# Altium project CPU.PrjPcb
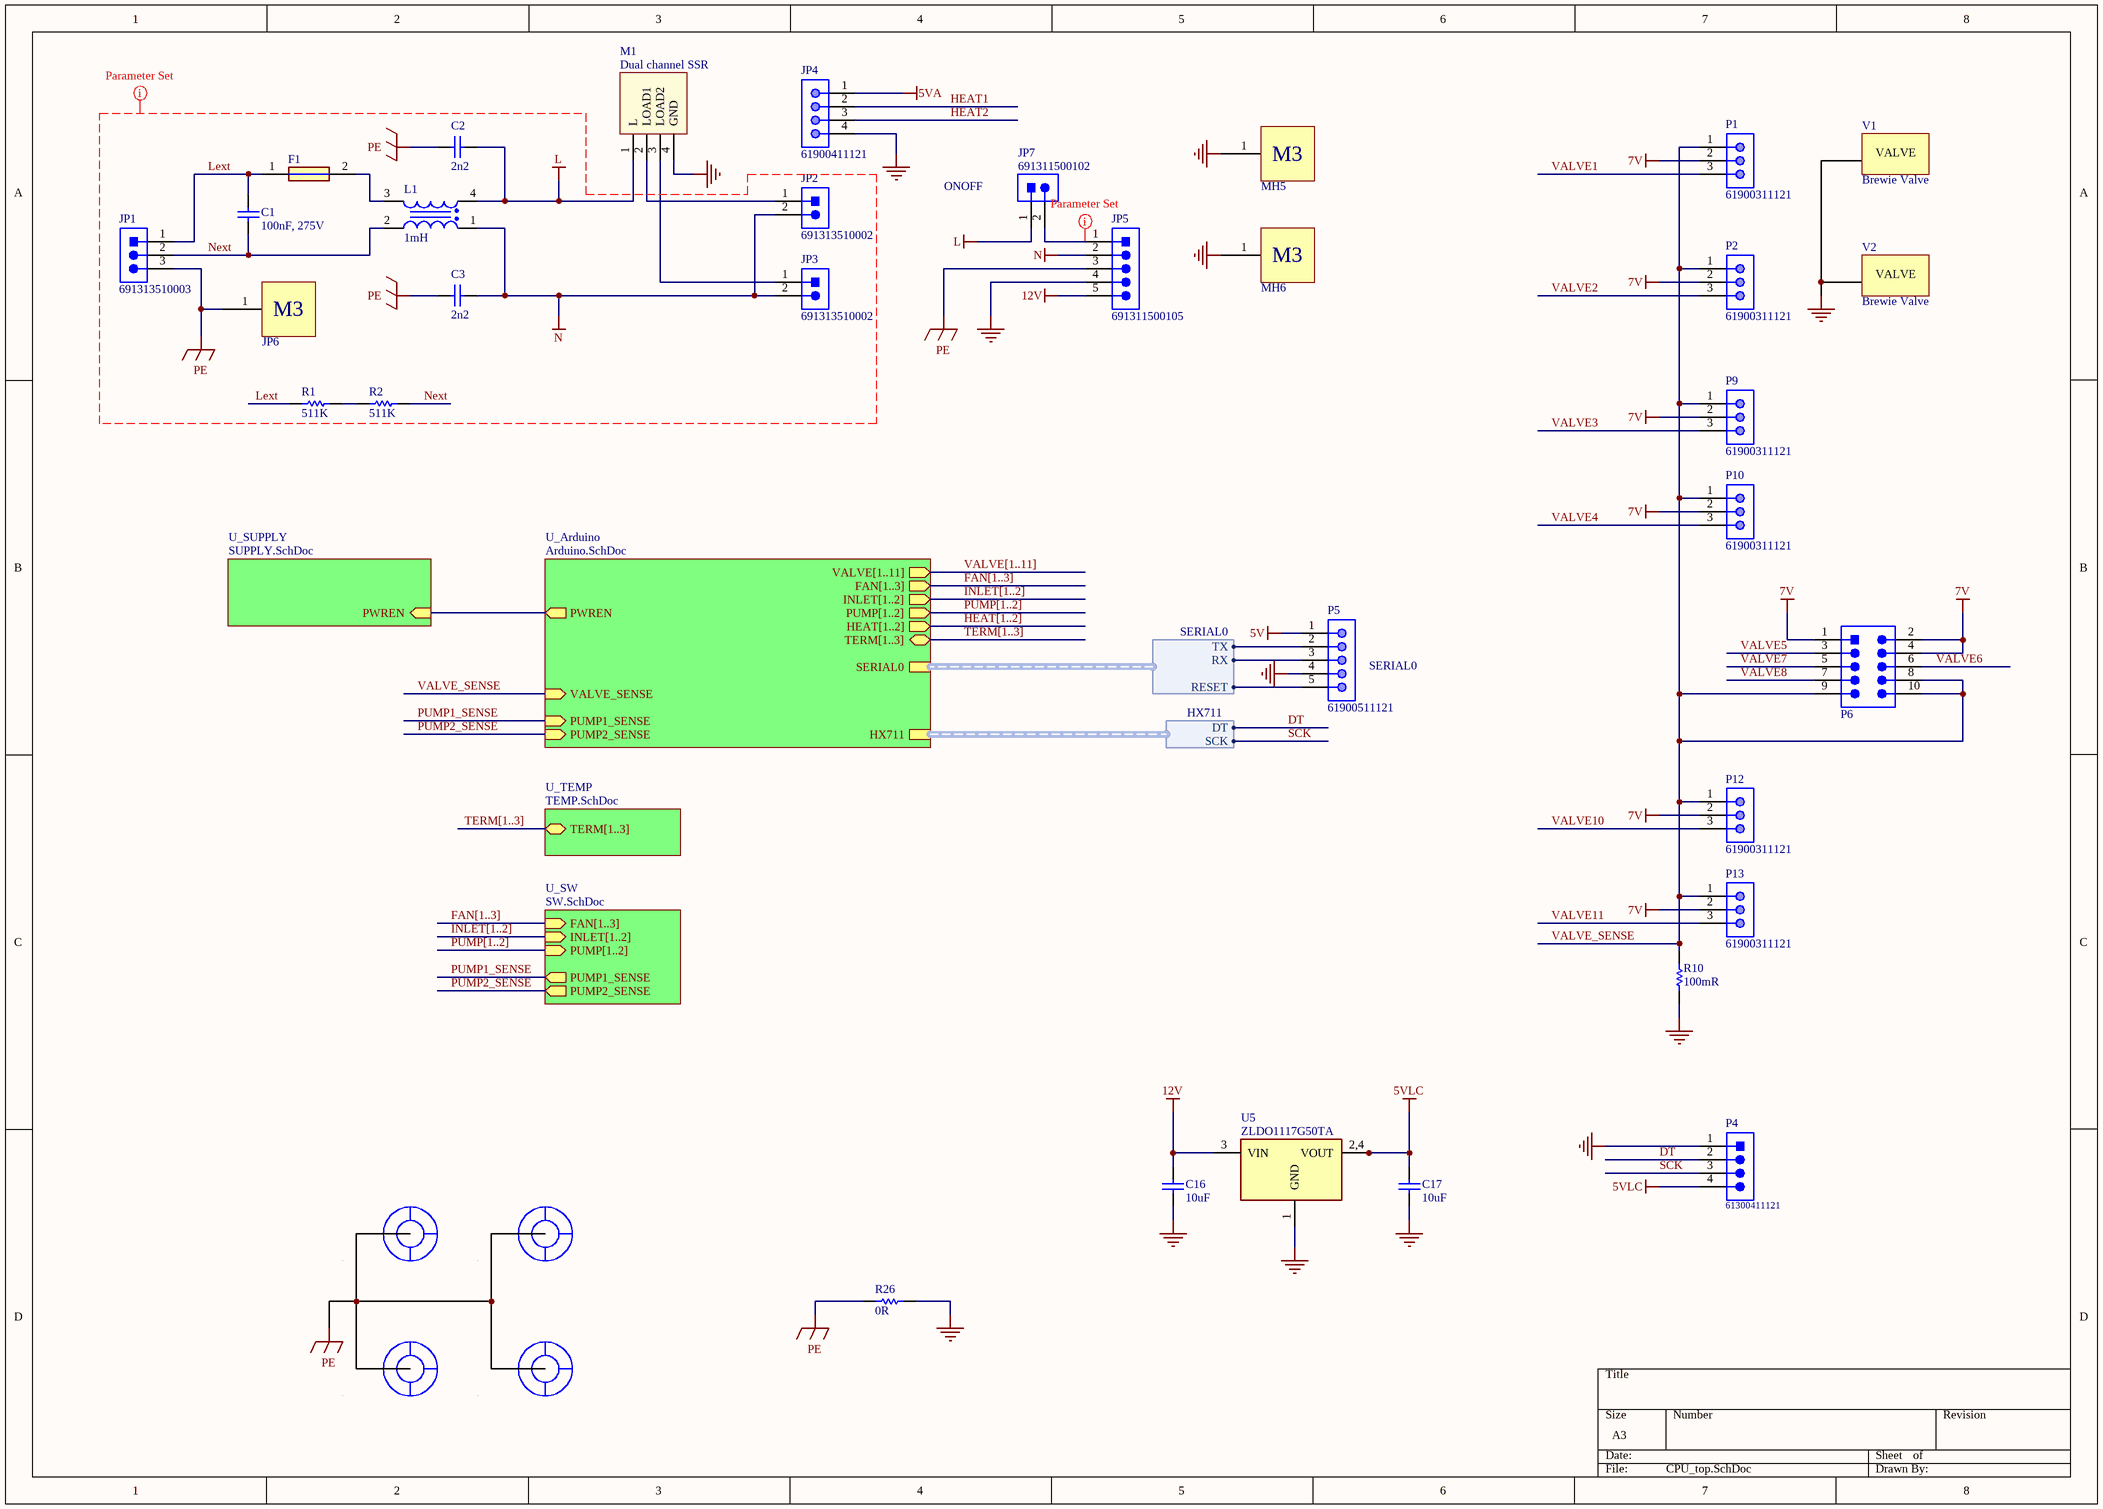
[diagram p0: CPU_top.SchDoc]
5 sheets, 95 parts. Net scope: hierarchical (ports join the sheet entries above them; power ports are global).
Board file: CPU.PcbDoc
Sheets:
  CPU_top.SchDoc
    U_SUPPLY = SUPPLY.SchDoc
    U_Arduino = Arduino.SchDoc
    U_TEMP = TEMP.SchDoc
    U_SW = SW.SchDoc

## Sheet CPU_top.SchDoc
size A3; SheetNumber: 1; SheetTotal: 5

### Parts
C1  100nF, 275V  [WCAP-FTX2_L13W7H13]
C2  value 2n2  [CAP CERDISC 9x5.5 P10 H13.0 (IPC RoHS)]  (hidden comment: CAP)
C3  value 2n2  [CAP CERDISC 9x5.5 P10 H13.0 (IPC RoHS)]  (hidden comment: CAP)
C16  value 10uF  [CAP_0805_H145 (_IPC_HD)]  (hidden comment: 10uF 0805)
C17  value 10uF  [CAP_0805_H145 (_IPC_HD)]  (hidden comment: 10uF 0805)
F1  SF-3812F1500T-2  [SF3812F1500T2]  (value not drawn)
JP1  691313510003  [691313510003]
JP2  691313510002  [691313510002]
JP3  691313510002  [691313510002]
JP4  61900411121  [61900411121]
JP5  691311500105  [691311500105]
JP6  Adafruit Standoff 6mm  [7466003]  (value not drawn)
JP7  691311500102  [691311500102]
L1  1mH  [744834101]
M1  Dual channel SSR  [SSR]
MH1  Mounting hole  [MECH_MHOLE_3.5-GND-2]  (value not drawn)  (no BOM)
MH2  Mounting hole  [MECH_MHOLE_3.5-GND-2]  (value not drawn)  (no BOM)
MH3  Mounting hole  [MECH_MHOLE_3.5-GND-2]  (value not drawn)  (no BOM)
MH4  Mounting hole  [MECH_MHOLE_3.5-GND-2]  (value not drawn)  (no BOM)
MH5  Adafruit Standoff 6mm  [7466003]  (value not drawn)
MH6  Adafruit Standoff 6mm  [7466003]  (value not drawn)
P1  61900311121  [61900311121]
P2  61900311121  [61900311121]
P4  61300411121  [61300411121]
P5  61900511121  [61900511121]
P6  61201021621  [61201021621]  (value not drawn)
P9  61900311121  [61900311121]
P10  61900311121  [61900311121]
P12  61900311121  [61900311121]
P13  61900311121  [61900311121]
R1  value 511K  [RES_1206_H060 (_IPC_MD)]  (hidden comment: 511K 1% 0,25W 200V 1206)
R2  value 511K  [RES_1206_H060 (_IPC_MD)]  (hidden comment: 511K 1% 0,25W 200V 1206)
R10  value 100mR  [RES_1206_H060 (_IPC_MD)]  (hidden comment: 100mR 1% 0,25W 200V 1206)
R26  value 0R  [RES_1206_H060 (_IPC_MD)]  (hidden comment: JUMPER)
U5  ZLDO1117G50TA  [SOT230P700X180-4N]
V1  Brewie Valve  [Valve2]
V2  Brewie Valve  [Valve2]

### Sub-sheets
U_Arduino = Arduino.SchDoc: VALVE[1..11] (out), FAN[1..3] (out), INLET[1..2] (out), PUMP[1..2] (out), HEAT[1..2] (out), PWREN (out), TERM[1..3] (bidir), SERIAL0 (harness SERIAL0), HX711 (harness HX711), VALVE_SENSE (in), PUMP1_SENSE (in), PUMP2_SENSE (in)
U_SUPPLY = SUPPLY.SchDoc: PWREN (in)
U_SW = SW.SchDoc: FAN[1..3] (in), INLET[1..2] (in), PUMP2_SENSE (out), PUMP1_SENSE (out), PUMP[1..2] (in)
U_TEMP = TEMP.SchDoc: TERM[1..3] (bidir)

### Harnesses
SERIAL0: TX, RX, RESET
HX711: DT, SCK

### Nets
5V: P5.1
5VA: JP4.1
5VLC: C17.2 P4.4 U5.2(VOUT_1) U5.4(VOUT)
7V: P1.2 P2.2 P6.1 P6.2 P6.4 P9.2 P10.2 P12.2 P13.2
12V: C16.2 JP5.5 U5.3(VIN)
GND: C16.1 C17.1 JP4.4 JP5.4 M1.4(GND) MH5.1 MH6.1 P4.1 P5.4 R10.1 R26.2 U5.1(GND) V1.1(CONN) V2.1(CONN)
L: C2.2 JP7.1 L1.4 M1.1(L)
N: C3.2 JP2.2 JP3.2 JP5.2 L1.1
PE: C2.1 C3.1 JP1.3 JP5.3 JP6.1 MH1.1(NET) MH2.1(NET) MH3.1(NET) MH4.1(NET) R26.1
DT: P4.2 ; sheet U_Arduino/HX711.DT
HEAT1: JP4.2
HEAT2: JP4.3
Lext: C1.2 F1.1 JP1.1 R1.1
Next: C1.1 JP1.2 L1.2 R2.2
PUMP1_SENSE: sheet U_Arduino/PUMP1_SENSE, sheet U_SW/PUMP1_SENSE
PUMP2_SENSE: sheet U_Arduino/PUMP2_SENSE, sheet U_SW/PUMP2_SENSE
PWREN: sheet U_SUPPLY/PWREN, sheet U_Arduino/PWREN
RESET: P5.5 ; sheet U_Arduino/SERIAL0.RESET
RX0: P5.3 ; sheet U_Arduino/SERIAL0.RX
SCK: P4.3 ; sheet U_Arduino/HX711.SCK
VALVE1: P1.3
VALVE2: P2.3
VALVE3: P9.3
VALVE4: P10.3
VALVE5: P6.3
VALVE6: P6.6
VALVE7: P6.5
VALVE8: P6.7
VALVE10: P12.3
VALVE11: P13.3
VALVE_SENSE: P1.1 P2.1 P6.8 P6.9 P6.10 P9.1 P10.1 P12.1 P13.1 R10.2 ; sheet U_Arduino/VALVE_SENSE
NetF1_2: F1.2 L1.3
NetJP2_1: JP2.1 M1.2(LOAD1)
NetJP3_1: JP3.1 M1.3(LOAD2)
NetJP5_1: JP5.1 JP7.2
NetP5_2: P5.2 ; sheet U_Arduino/SERIAL0.TX
NetR1_2: R1.2 R2.1

### Buses and harness runs
bus FAN[1..3] = sheet U_Arduino/FAN[1..3]
bus FAN[1..3] = sheet U_SW/FAN[1..3]
bus HEAT[1..2] = sheet U_Arduino/HEAT[1..2]
bus INLET[1..2] = sheet U_Arduino/INLET[1..2]
bus INLET[1..2] = sheet U_SW/INLET[1..2]
bus PUMP[1..2] = sheet U_Arduino/PUMP[1..2]
bus PUMP[1..2] = sheet U_SW/PUMP[1..2]
bus TERM[1..3] = sheet U_Arduino/TERM[1..3]
bus TERM[1..3] = sheet U_TEMP/TERM[1..3]
bus VALVE[1..11] = sheet U_Arduino/VALVE[1..11]

### Layout directives
net class HV: L, Lext, N, NetJP5_1, Next, PE

### Notes on the sheet
- ONOFF
- (near P5) SERIAL0
- (in symbol CONNM3) M3
- (in symbol Valve) VALVE
- (in symbol ZLDO1117G50TA) 2,4

### Library data of the parts
C1 = 890324023023: WCAP-FTX2 Film Capacitor, THT, L13W7H13, 100nF, 275V; Manufacturer: Wurth Elektronik; Insulation Resistance: 30000MOhm; Dissipation Factor@100kHz: 0.5%; Dissipation Factor@1kHz: 0.1%; Rated Voltage: 275VAC; Rate of Voltage Rise: 300V/us; Pitch: 10mm; Technical Reference: MX2P010104K275ASPB16000; Capacitance Tolerance: +/-10%; ComponentLink1Description: Manufacturer; ComponentLink1URL: http://www.we-online.de; ComponentLink2Description: Datasheet; ComponentLink2URL: https://www.we-online.com/catalog/datasheet/890324023023.pdf; Length: 13mm; Mounting Technology: THT; Operating Temperature: -40 to +105degC; Manufacturer Part Number: 890324023023; Width: 7mm; Capacitance: 100nF; Dissipation Factor@10kHz: 0.1%; Height: 13mm; Packaging: Carton; Published Date: May 2020
C2 C3 = 2235-0004: Cap X1Y1 2n2 400Vac 20% Y5V 4M E; Component: C921U222MVVDBA7317; Type: Standard; Designator: C; Curr: Typ X1/Y1; PCB Lib: EEPAB Hole mount.PcbLib; Scm Lib: Discrete.SchLib; Check: N; Create: Urband; Part Number: 2235-0004; EEPAB Prt Nr: 2235-0004; Volt: 400Vac; Tol: 20%; Qty: 1; Temp: E; PCB Footprint: CAP CERDISC 9x5.5 P10 H13.0 (IPC RoHS); Scm Symbol: CAP; Mfg Part Nr: C921U222MVVDBA7317; Supplier 1: Arrow; Supplier Part Number 1: C921U222MVVDBA7317; Supplier 2: Avnet; Supplier 3: Digi-Key; Supplier Part Number 3: 399-9487-1-ND; Supplier 4: Distrelec; Supplier 5: Farnell; Supplier Part Number 5: 2440214; Supplier 6: Future Electronics; Supplier 7: Mouser; Supplier Part Number 7: 80-C921U222MVVDBAP; Supplier 8: RSComponents; Supplier 9: Rutronik; Supplier 10: TTI
C16 C17 = 0805YD106KAT2A: CAP CER 10UF 16V X5R 0805; Type: Standard; Designator: C?; PCB Lib: MUAB_CAP.PcbLib; Scm Lib: Discrete.SchLib; Tol: 10%; Volt: 16V; Part Number: 0805YD106KAT2A; Dielec: X5R; Qty: 1; Supplier 1: Arrow; Supplier 2: Avnet; Supplier 3: Digi-Key; Supplier Part Number 3: 478-5165-1-ND; Supplier 4: Distrelec; Supplier 5: Farnell; Supplier 6: Future Electronics; Supplier 7: Mouser; Supplier Part Number 7: 581-0805YD106K; Supplier 8: RSComponents; Supplier 9: Rutronik; Supplier 10: SEED OPL
F1 = SF-3812F1500T-2: Fuse; Manufacturer_Name: Bourns; Datasheet Link: https://componentsearchengine.com//SF-3812F1500T-2.pdf; Height: 3.3mm; Manufacturer_Part_Number: SF-3812F1500T-2; Mouser Part Number: 652-SF-3812F1500T-2; Mouser Price/Stock: https://www.mouser.co.uk/ProductDetail/Bourns/SF-3812F1500T-2?qs=vLWxofP3U2y%252BowuZb8%2FTgg%3D%3D
JP1 = 691313510003: WR-TBL Serie 313 Close Horizontal PCB Header, Pluggable, THT, pitch 5.08mm, 3p; Manufacturer: Wurth Elektronik; Modularity: No; Pin Number: 3; Rated Current [UL]: 20A; Working Voltage [UL]: 300VAC; ComponentLink1Description: Manufacturer; ComponentLink1URL: http://www.we-online.de; ComponentLink2URL: https://katalog.we-online.de/em/datasheet/691313510003.pdf; ComponentLink2Description: Datasheet; Mounting Technology: THT; Manufacturer Part Number: 691313510003; Packaging: Box; Operating Temperature: -40 to +105degC; PCB/Cable/Panel: PCB; Pitch: 5.08mm; Published Date: Feburary 2021; Type: Horizontal; Application: Pluggable
JP2 JP3 = 691313510002: WR-TBL Serie 313 Close Horizontal PCB Header, Pluggable, THT, pitch 5.08mm, 2p; Manufacturer: Wurth Elektronik; Modularity: No; Pin Number: 2; Rated Current [UL]: 20A; Working Voltage [UL]: 300VAC; ComponentLink1Description: Manufacturer; ComponentLink1URL: http://www.we-online.de; ComponentLink2URL: https://katalog.we-online.de/em/datasheet/691313510002.pdf; ComponentLink2Description: Datasheet; Mounting Technology: THT; Manufacturer Part Number: 691313510002; Packaging: Box; Operating Temperature: -40 to +105degC; PCB/Cable/Panel: PCB; Pitch: 5.08mm; Published Date: Feburary 2021; Type: Horizontal; Application: Pluggable
JP4 = 61900411121: WR-WTB THT Male Vertical Locking Header, pitch 2.54mm, 4p; Pin Number: 4; Contact Resistance: 20mOhm; Rated Current: 3A; Withstanding Voltage: 1000VAC; Working Voltage: 250VAC; ComponentLink1Description: Manufacturer; ComponentLink1URL: http://www.we-online.de; ComponentLink2Description: Datasheet; ComponentLink2URL: https://www.we-online.com/catalog/datasheet/61900411121.pdf; Pitch: 2.54mm; Published Date: January 2020; Publisher: Wurth Elektronik; Mounting Technology: THT; Packaging: Bag; Operating Temperature: -40 to +105degC; Part Number: 61900411121; Gender: Male; Type: Vertical
JP5 = 691311500105: WR-TBL Serie 311 Close Vertical PCB Header, Pluggable, THT, pitch 5.08mm, 5p; Manufacturer: Wurth Elektronik; Modularity: No; Pin Number: 5; Rated Current [UL]: 20A; Working Voltage [UL]: 300VAC; ComponentLink1Description: Manufacturer; ComponentLink1URL: http://www.we-online.de; ComponentLink2URL: https://katalog.we-online.de/em/datasheet/691311500105.pdf; ComponentLink2Description: Datasheet; Mounting Technology: THT; Manufacturer Part Number: 691311500105; Packaging: Box; Operating Temperature: -40 to +105degC; PCB/Cable/Panel: PCB; Pitch: 5.08mm; Published Date: Feburary 2021; Type: Vertical; Application: Pluggable
JP6 MH5 MH6 = CONNM3: Manufacturer: Adafruit; Height: 6mm
JP7 = 691311500102: WR-TBL Serie 311 Close Vertical PCB Header, Pluggable, THT, pitch 5.08mm, 2p; Manufacturer: Wurth Elektronik; Modularity: No; Pin Number: 2; Rated Current [UL]: 20A; Working Voltage [UL]: 300VAC; ComponentLink1Description: Manufacturer; ComponentLink1URL: http://www.we-online.de; ComponentLink2URL: https://katalog.we-online.de/em/datasheet/691311500102.pdf; ComponentLink2Description: Datasheet; Mounting Technology: THT; Manufacturer Part Number: 691311500102; Packaging: Box; Operating Temperature: -40 to +105degC; PCB/Cable/Panel: PCB; Pitch: 5.08mm; Published Date: Feburary 2021; Type: Vertical; Application: Pluggable
L1 = 744834101: WE-CMBH Common Mode Power Line Choke, Type L, 1mH; Manufacturer: Wurth Elektronik; Rated Current: 10A; DC Resistance max.: 12.5mOhm; Insulation Test Voltage: 1500VAC; Rated Voltage: 250VAC; ComponentLink1Description: Manufacturer; ComponentLink1URL: http://www.we-online.de; ComponentLink2Description: Datasheet; ComponentLink2URL: https://www.we-online.com/catalog/datasheet/744834101.pdf; Manufacturer Part Number: 744834101; Published Date: April 2020; Inductance: 1mH; Operating Temperature: -40 to +125degC; Mounting Technology: THT; Packaging: Tray; Size: Type L
M1 = SSR
MH1-MH4 = MECH_MHOLE_NET
P1 P2 P9 P10 P12 P13 = 61900311121: WR-WTB THT Male Vertical Locking Header, pitch 2.54mm, 3p; Pin Number: 3; Contact Resistance: 20mOhm; Rated Current: 3A; Withstanding Voltage: 1000VAC; Working Voltage: 250VAC; ComponentLink1Description: Manufacturer; ComponentLink1URL: http://www.we-online.de; ComponentLink2Description: Datasheet; ComponentLink2URL: https://www.we-online.com/catalog/datasheet/61900311121.pdf; Pitch: 2.54mm; Published Date: January 2020; Publisher: Wurth Elektronik; Mounting Technology: THT; Packaging: Bag; Operating Temperature: -40 to +105degC; Part Number: 61900311121; Gender: Male; Type: Vertical
P4 = 61300411121: WR-PHD Pin Header, THT, pitch 2.54mm, Single Row, Vertical, 4p; Manufacturer: Wurth Elektronik; Pin Number: 4; Rated Current: 3A; Working Voltage: 250VAC; Withstanding Voltage: 500VAC; Contact Resistance: 20mOhm; ComponentLink1Description: Manufacturer; ComponentLink1URL: http://www.we-online.de; ComponentLink2Description: Datasheet; ComponentLink2URL: https://www.we-online.com/catalog/datasheet/61300411121.pdf; Manufacturer Part Number: 61300411121; Pitch: 2.54mm; Operating Temperature: -40 to +105degC; Mounting Technology: THT; Packaging: Bag; Gender: Pin Header; Row Number: Single; Orientation: Vertical
P5 = 61900511121: WR-WTB THT Male Vertical Locking Header, pitch 2.54mm, 5p; Pin Number: 5; Contact Resistance: 20mOhm; Rated Current: 3A; Withstanding Voltage: 1000VAC; Working Voltage: 250VAC; ComponentLink1Description: Manufacturer; ComponentLink1URL: http://www.we-online.de; ComponentLink2Description: Datasheet; ComponentLink2URL: https://www.we-online.com/catalog/datasheet/61900511121.pdf; Pitch: 2.54mm; Published Date: January 2020; Publisher: Wurth Elektronik; Mounting Technology: THT; Packaging: Bag; Operating Temperature: -40 to +105degC; Part Number: 61900511121; Gender: Male; Type: Vertical
P6 = 61201021621: WR-BHD Box Header, Male, pitch 2.54mm, THT, Straight, 10p; Manufacturer: Wurth Elektronik; Contact Resistance: 20mOhm; Insulation Resistance: 1000MOhm; Number of Positions: 10; Rated Current: 3A; Withstanding Voltage: 500V; Working Voltage: 250V; ComponentLink1Description: Manufacturer Link; ComponentLink1URL: http://www.we-online.de; ComponentLink2Description: Datasheet; ComponentLink2URL: https://www.we-online.com/catalog/datasheet/61201021621.pdf; Gender: Male; Height: 9.1mm; Length: 20.36mm; Manufacturer Part Number: 61201021621; Mounting Technology: THT; Number of Rows: 2; Operating Temperature max.: 105C; Operating Temperature min.: -40C; Orientation: Straight; Packaging: Tray; Pitch: 2.54mm; Width: 9.1mm
R1 R2 = RES511K1%1206: Designator: R; PCB Lib: MUAB_RES.PcbLib; Scm Lib: Discrete.SchLib; Watt: 0,25W; Tol: 1%; Part Number: RES511K1%1206; Type: Standard; Volt: 200V; Qty: 1; Supplier 1: Arrow; Supplier 2: Avnet; Supplier 3: Digi-Key; Supplier 4: Distrelec; Supplier 5: Farnell; Supplier 6: Future Electronics; Supplier 7: Mouser; Supplier 8: RSComponents; Supplier 9: Rutronik; Supplier 10: SEED OPL
R10 = RES100mR1%1206: Designator: R; PCB Lib: MUAB_RES.PcbLib; Scm Lib: Discrete.SchLib; Watt: 0,25W; Tol: 1%; Part Number: RES100mR1%1206; Type: Standard; Volt: 200V; Qty: 1; Supplier 1: Arrow; Supplier 2: Avnet; Supplier 3: Digi-Key; Supplier 4: Distrelec; Supplier 5: Farnell; Supplier 6: Future Electronics; Supplier 7: Mouser; Supplier 8: RSComponents; Supplier 9: Rutronik; Supplier 10: SEED OPL
R26 = JUMPER1206: Tol: 1%; Designator: R; PCB Lib: MUAB_RES.PcbLib; Scm Lib: Discrete.SchLib; Volt: 200V; Watt: 0,25W; Part Number: JUMPER1206; Type: Standard; Qty: 1; Supplier 1: Arrow; Supplier 2: Avnet; Supplier 3: Digi-Key; Supplier 4: Distrelec; Supplier 5: Farnell; Supplier 6: Future Electronics; Supplier 7: Mouser; Supplier 8: RSComponents; Supplier 9: Rutronik; Supplier 10: SEED OPL
U5 = ZLDO1117G50TA: IC REG LINEAR 3.3V 1A SOT223; Manufacturer_Name: Diodes Inc.; Designator: U; Volt: 18V; Volt Out: 5.0V; Temp: I; Datasheet Link: https://datasheet.datasheetarchive.com/originals/distributors/Datasheets-DIO/DSADIO2000767.pdf; Height: 1.8mm; Manufacturer_Part_Number: ZLDO1117G33TA; Mouser Part Number: 522-ZLDO1117G33TA; Mouser Price/Stock: https://www.mouser.co.uk/ProductDetail/Diodes-Incorporated/ZLDO1117G33TA?qs=4YT44p7w2bvlytOS2j%2F0vw%3D%3D; Arrow Part Number: ZLDO1117G33TA; Arrow Price/Stock: https://www.arrow.com/en/products/zldo1117g33ta/diodes-incorporated?region=nac; Part Number: ZLDO1117G50TA; Component: ZLDO1117G50TA; Type: Standard; Curr: 1A; Qty: 1; Supplier 1: Arrow; Supplier 2: Avnet; Supplier 3: Digi-Key; Supplier Part Number 3: ZLDO1117G50DICT-ND; Supplier 4: Distrelec; Supplier 5: Farnell; Supplier 6: Future Electronics; Supplier 7: Mouser; Supplier Part Number 7: 522-ZLDO1117G50TA; Supplier 8: RSComponents; Supplier 9: Rutronik; Supplier 10: TTI
V1 V2 = Valve

## Sheet SUPPLY.SchDoc
size A3; SheetNumber: 2; SheetTotal: 2
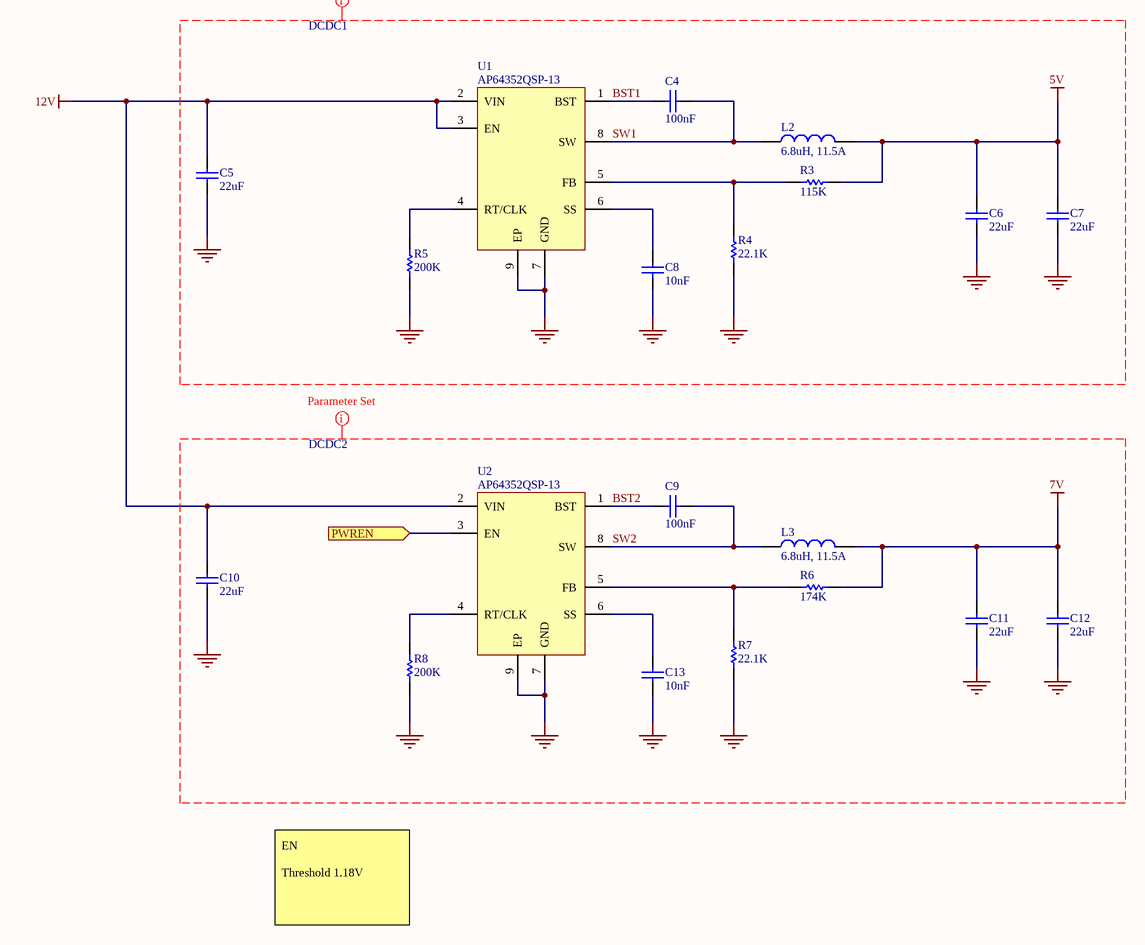
[diagram p1: SUPPLY.SchDoc]

### Parts
C4  value 100nF  [CAP_0603_H090 (_IPC_MD)]  (hidden comment: 100nF 0603)
C5  value 22uF  [CAP_1210_H090 (_IPC_HD)]  (hidden comment: 22uF 1210)
C6  value 22uF  [CAP_1210_H090 (_IPC_HD)]  (hidden comment: 22uF 1210)
C7  value 22uF  [CAP_1210_H090 (_IPC_HD)]  (hidden comment: 22uF 1210)
C8  value 10nF  [CAP_0603_H090 (_IPC_MD)]  (hidden comment: 10nF 0603)
C9  value 100nF  [CAP_0603_H090 (_IPC_MD)]  (hidden comment: 100nF 0603)
C10  value 22uF  [CAP_1210_H090 (_IPC_HD)]  (hidden comment: 22uF 1210)
C11  value 22uF  [CAP_1210_H090 (_IPC_HD)]  (hidden comment: 22uF 1210)
C12  value 22uF  [CAP_1210_H090 (_IPC_HD)]  (hidden comment: 22uF 1210)
C13  value 10nF  [CAP_0603_H090 (_IPC_MD)]  (hidden comment: 10nF 0603)
L2  6.8uH, 11.5A  [WE-HCC_1090]
L3  6.8uH, 11.5A  [WE-HCC_1090]
R3  value 115K  [RES_0603_H050 (_IPC_MD)]  (hidden comment: 115K 1% 0,1W 75V 0603)
R4  value 22.1K  [RES_0603_H050 (_IPC_MD)]  (hidden comment: 22.1K 1% 0,1W 75V 0603)
R5  value 200K  [RES_0603_H050 (_IPC_MD)]  (hidden comment: 200K 1% 0,1W 75V 0603)
R6  value 174K  [RES_0603_H050 (_IPC_MD)]  (hidden comment: 174K 1% 0,1W 75V 0603)
R7  value 22.1K  [RES_0603_H050 (_IPC_MD)]  (hidden comment: 22.1K 1% 0,1W 75V 0603)
R8  value 200K  [RES_0603_H050 (_IPC_MD)]  (hidden comment: 200K 1% 0,1W 75V 0603)
U1  AP64352QSP-13  [SOIC127P600X163-9N]
U2  AP64352QSP-13  [SOIC127P600X163-9N]

### Ports
PWREN (in)

### Nets
5V: C6.2 C7.2 L2.2 R3.2
7V: C11.2 C12.2 L3.2 R6.2
12V: C5.2 C10.2 U1.2(VIN) U1.3(EN) U2.2(VIN)
GND: C5.1 C6.1 C7.1 C8.1 C10.1 C11.1 C12.1 C13.1 R4.1 R5.1 R7.1 R8.1 U1.7(GND) U1.9(EP) U2.7(GND) U2.9(EP)
BST1: C4.2 U1.1(BST)
BST2: C9.2 U2.1(BST)
PWREN: U2.3(EN) ; port PWREN
SW1: C4.1 L2.1 U1.8(SW)
SW2: C9.1 L3.1 U2.8(SW)
NetC8_2: C8.2 U1.6(SS)
NetC13_2: C13.2 U2.6(SS)
NetR3_1: R3.1 R4.2 U1.5(FB)
NetR5_2: R5.2 U1.4(RT/CLK)
NetR6_1: R6.1 R7.2 U2.5(FB)
NetR8_2: R8.2 U2.4(RT/CLK)

### Layout directives
CompClassName: DCDC1: 5V, BST1, GND, SW1
CompClassName: DCDC2: 7V, BST2, GND, SW2

### Notes on the sheet
- EN
  Threshold 1.18V

### Library data of the parts
C4 C9 = CL10B104KB8NNNC: CAP CER 100NF 50V X7R 0603; Type: Standard; Designator: C?; PCB Lib: MUAB_CAP.PcbLib; Scm Lib: Discrete.SchLib; Tol: 10%; Volt: 50V; Part Number: CL10B104KB8NNNC; Dielec: X7R; Qty: 1; Supplier 1: Arrow; Supplier 2: Avnet; Supplier 3: Digi-Key; Supplier Part Number 3: 1276-1000-1-ND; Supplier 4: Distrelec; Supplier 5: Farnell; Supplier 6: Future Electronics; Supplier 7: Mouser; Supplier Part Number 7: 187-CL10B104KB8NNNC; Supplier 8: RSComponents; Supplier 9: Rutronik; Supplier 10: SEED OPL
C5-C7 C10-C12 = MA1210XR226K250ER: CAP CER 22UF 25V X7R 1210; Type: Standard; Designator: C?; PCB Lib: MUAB_CAP.PcbLib; Scm Lib: Discrete.SchLib; Tol: 10%; Volt: 25V; Part Number: MA1210XR226K250ER; Dielec: X7R; Qty: 1; Supplier 1: Arrow; Supplier 2: Avnet; Supplier 3: Digi-Key; Supplier 4: Distrelec; Supplier 5: Farnell; Supplier 6: Future Electronics; Supplier 7: Mouser; Supplier 8: RSComponents; Supplier 9: Rutronik; Supplier 10: SEED OPL
C8 C13 = CGA3E2C0G1H103J080AA: CAP CER 10NF 50V C0G/NP0 0603; Type: Standard; Designator: C?; PCB Lib: MUAB_CAP.PcbLib; Scm Lib: Discrete.SchLib; Dielec: C0G; Tol: 5%; Volt: 50V; Part Number: CGA3E2C0G1H103J080AA; Qty: 1; Supplier 1: Arrow; Supplier 2: Avnet; Supplier 3: Digi-Key; Supplier Part Number 3: 445-6916-1-ND; Supplier 4: Distrelec; Supplier 5: Farnell; Supplier 6: Future Electronics; Supplier 7: Mouser; Supplier Part Number 7: 810-CGA3E2C0G1H103J; Supplier 8: RSComponents; Supplier 9: Rutronik; Supplier 10: SEED OPL
L2 L3 = 7443330680: WE-HCC SMT High Current Cube Inductor, size 1090, 6.8uH, 11.5A; Manufacturer: Wurth Elektronik; Saturation Current: 11A; DC Resistance typ.: 14.15mOhm; DC Resistance max.: 15mOhm; Rated Inductance: 4.5uH; Material: Ferrite; Self Resonant Frequency: 40MHz; ComponentLink1Description: Manufacturer; ComponentLink1URL: http://www.we-online.de; ComponentLink2Description: Datasheet; ComponentLink2URL: https://www.we-online.com/catalog/datasheet/7443330680.pdf; Mounting Technology: SMT; Operating Temperature: -40 to +125degC; Packaging: Tape and Reel; Manufacturer Part Number: 7443330680; Rated Current: 11.5A; Inductance: 6.8uH; Size: 1090; Height: 9.3mm; Length: 10.9mm; Width: 10mm
R3 = RES115K1%0603: Designator: R; PCB Lib: MUAB_RES.PcbLib; Scm Lib: Discrete.SchLib; Watt: 0,1W; Tol: 1%; Part Number: RES115K1%0603; Type: Standard; Volt: 75V; Qty: 1; Supplier 1: Arrow; Supplier 2: Avnet; Supplier 3: Digi-Key; Supplier 4: Distrelec; Supplier 5: Farnell; Supplier 6: Future Electronics; Supplier 7: Mouser; Supplier 8: RSComponents; Supplier 9: Rutronik; Supplier 10: SEED OPL
R4 R7 = RES22.1K1%0603: Designator: R; PCB Lib: MUAB_RES.PcbLib; Scm Lib: Discrete.SchLib; Watt: 0,1W; Tol: 1%; Part Number: RES22.1K1%0603; Type: Standard; Volt: 75V; Qty: 1; Supplier 1: Arrow; Supplier 2: Avnet; Supplier 3: Digi-Key; Supplier 4: Distrelec; Supplier 5: Farnell; Supplier 6: Future Electronics; Supplier 7: Mouser; Supplier 8: RSComponents; Supplier 9: Rutronik; Supplier 10: SEED OPL
R5 R8 = RES200K1%0603: Designator: R; PCB Lib: MUAB_RES.PcbLib; Scm Lib: Discrete.SchLib; Watt: 0,1W; Tol: 1%; Part Number: RES200K1%0603; Type: Standard; Volt: 75V; Qty: 1; Supplier 1: Arrow; Supplier 2: Avnet; Supplier 3: Digi-Key; Supplier 4: Distrelec; Supplier 5: Farnell; Supplier 6: Future Electronics; Supplier 7: Mouser; Supplier 8: RSComponents; Supplier 9: Rutronik; Supplier 10: SEED OPL
R6 = RES174K1%0603: Designator: R; PCB Lib: MUAB_RES.PcbLib; Scm Lib: Discrete.SchLib; Watt: 0,1W; Tol: 1%; Part Number: RES174K1%0603; Type: Standard; Volt: 75V; Qty: 1; Supplier 1: Arrow; Supplier 2: Avnet; Supplier 3: Digi-Key; Supplier 4: Distrelec; Supplier 5: Farnell; Supplier 6: Future Electronics; Supplier 7: Mouser; Supplier 8: RSComponents; Supplier 9: Rutronik; Supplier 10: SEED OPL
U1 U2 = AP64352QSP-13: DCDC CONV HV BUCK SO-8EP T&R 4K; Designator: U; Volt: 3.8V to 40V; Volt Out: ADJ; Curr: 3.5A; Temp: I; Part Number: AP64352QSP-13; Component: AP64352; Type: Standard; Qty: 1; Supplier 1: Arrow; Supplier 2: Avnet; Supplier 3: Digi-Key; Supplier Part Number 3: 31-AP64352QSP-13CT-ND; Supplier 4: Distrelec; Supplier 5: Farnell; Supplier 6: Future Electronics; Supplier 7: Mouser; Supplier Part Number 7: 621-AP64352QSP-13; Supplier 8: RSComponents; Supplier 9: Rutronik; Supplier 10: TTI

## Sheet Arduino.SchDoc
size A3; SheetNumber: 3; SheetTotal: 5
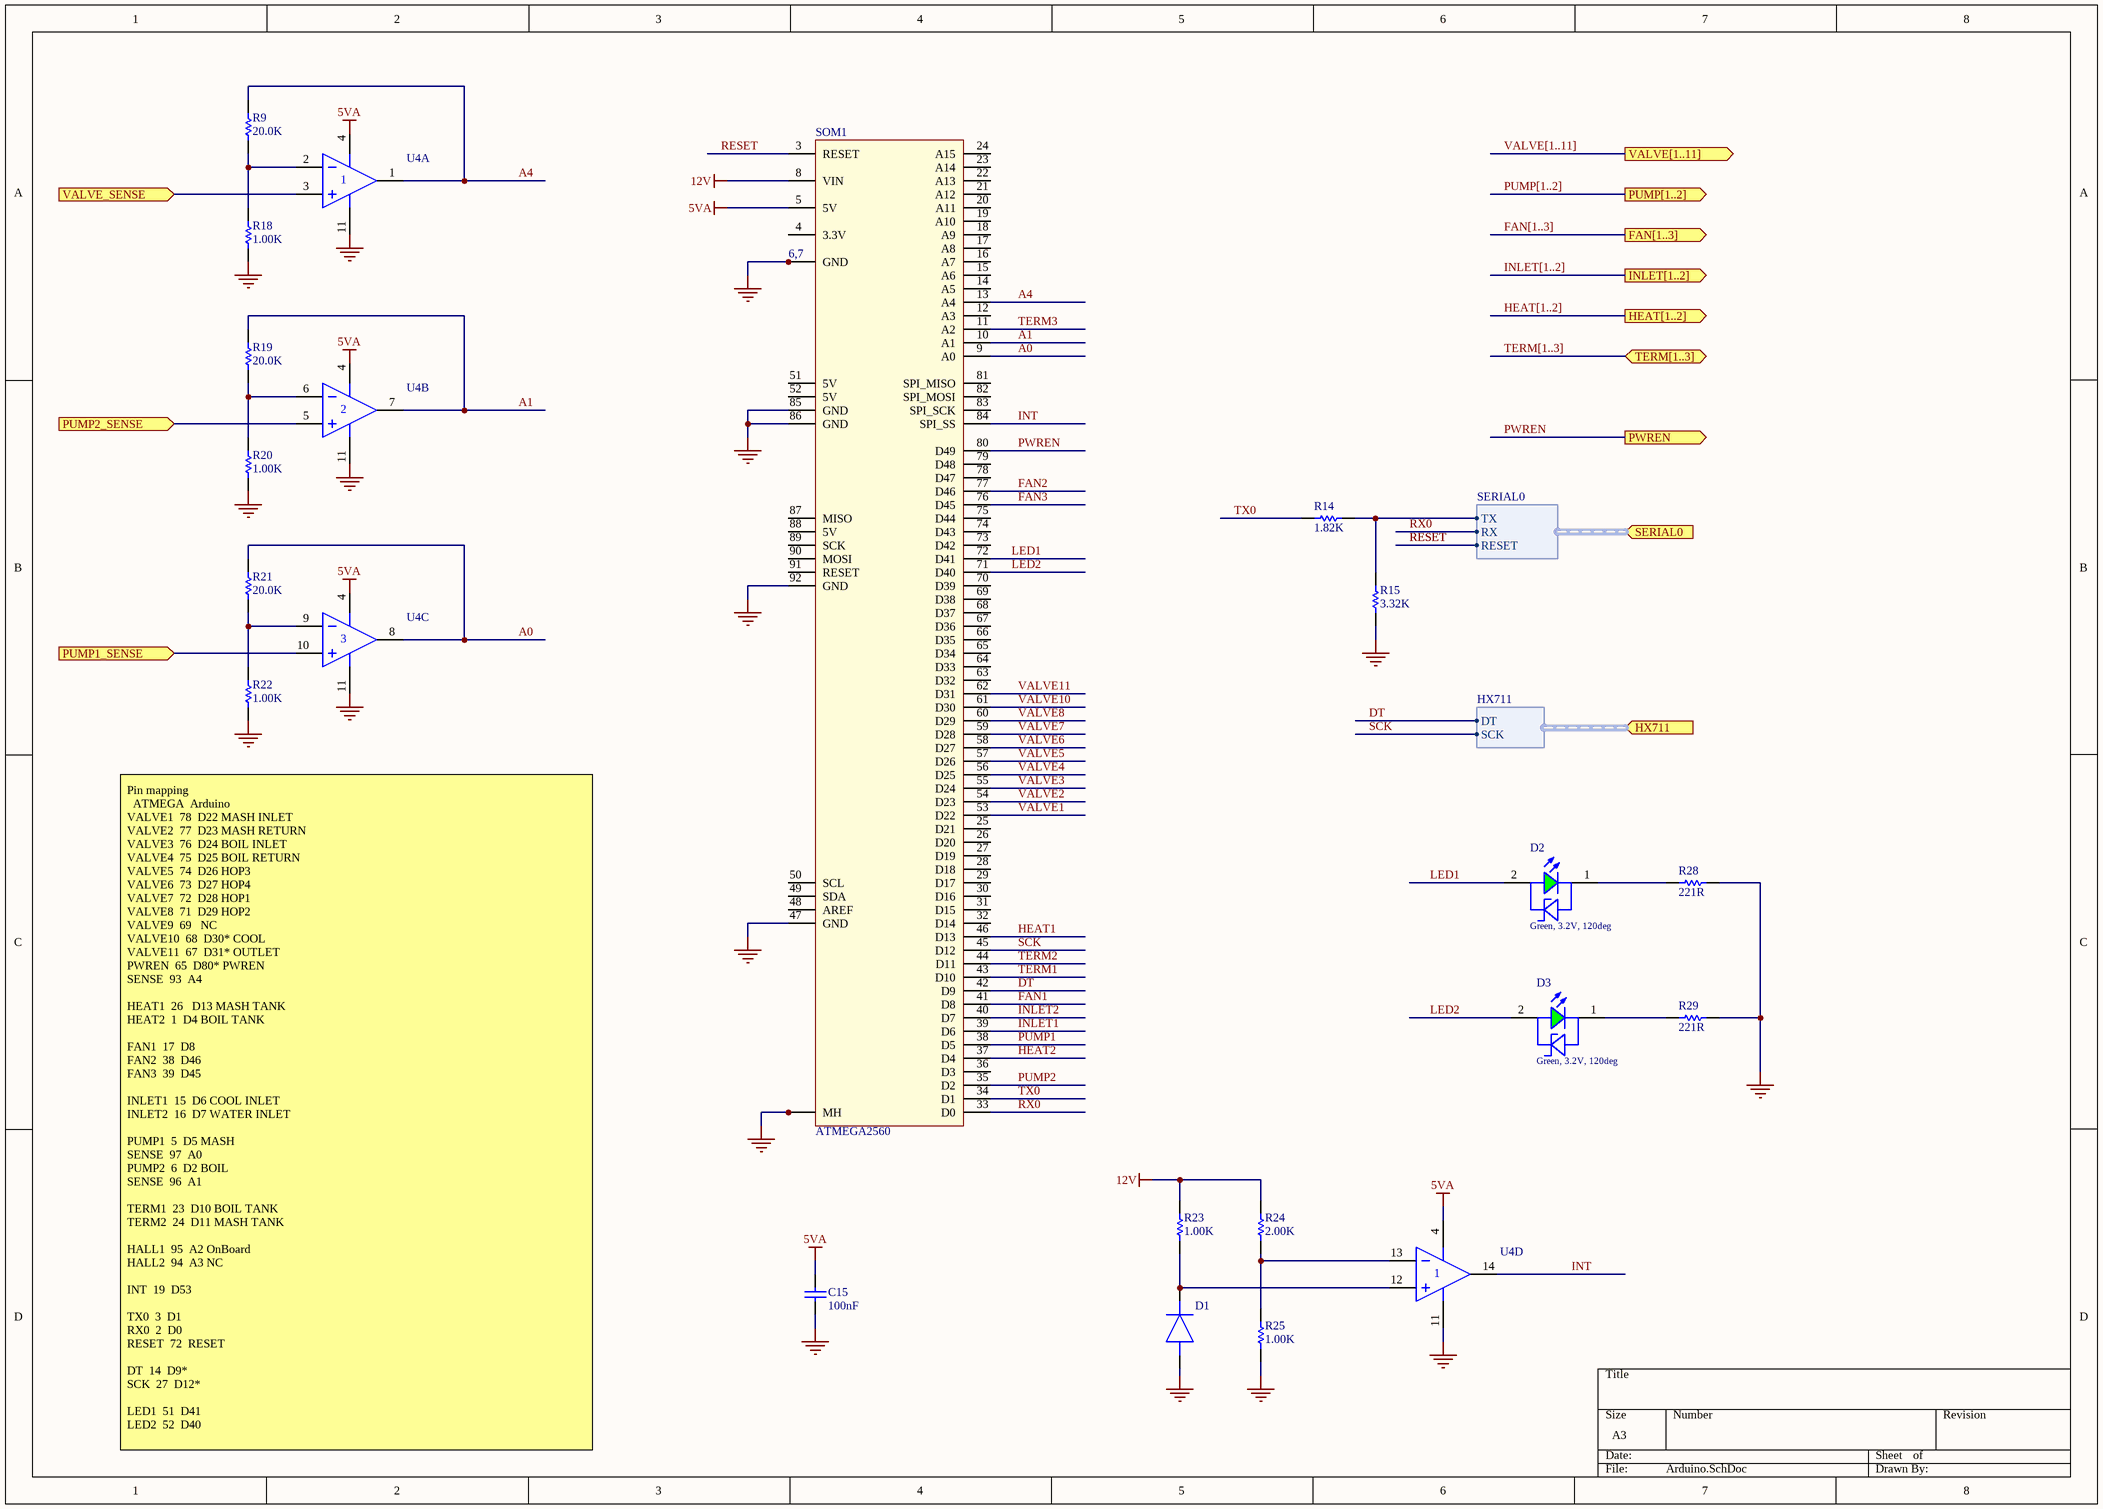
[diagram p2: Arduino.SchDoc]

### Parts
C15  value 100nF  [CAP_0603_H090 (_IPC_MD)]  (hidden comment: 100nF 0603)
D1  LL4148-GS18  [SOD-80]  (value not drawn)
D2  Green, 3.2V, 120deg  [WL-SMCC_0603_GS_BS]
D3  Green, 3.2V, 120deg  [WL-SMCC_0603_GS_BS]
R9  value 20.0K  [RES_0603_H050 (_IPC_MD)]  (hidden comment: 20.0K 1% 0,1W 75V 0603)
R14  value 1.82K  [RES_0603_H050 (_IPC_MD)]  (hidden comment: 1.82K 1% 0,1W 75V 0603)
R15  value 3.32K  [RES_0603_H050 (_IPC_MD)]  (hidden comment: 3.32K 1% 0,1W 75V 0603)
R18  value 1.00K  [RES_0603_H050 (_IPC_MD)]  (hidden comment: 1.00K 1% 0,1W 75V 0603)
R19  value 20.0K  [RES_0603_H050 (_IPC_MD)]  (hidden comment: 20.0K 1% 0,1W 75V 0603)
R20  value 1.00K  [RES_0603_H050 (_IPC_MD)]  (hidden comment: 1.00K 1% 0,1W 75V 0603)
R21  value 20.0K  [RES_0603_H050 (_IPC_MD)]  (hidden comment: 20.0K 1% 0,1W 75V 0603)
R22  value 1.00K  [RES_0603_H050 (_IPC_MD)]  (hidden comment: 1.00K 1% 0,1W 75V 0603)
R23  value 1.00K  [RES_0603_H050 (_IPC_MD)]  (hidden comment: 1.00K 1% 0,1W 75V 0603)
R24  value 2.00K  [RES_0603_H050 (_IPC_MD)]  (hidden comment: 2.00K 1% 0,1W 75V 0603)
R25  value 1.00K  [RES_0603_H050 (_IPC_MD)]  (hidden comment: 1.00K 1% 0,1W 75V 0603)
R28  value 221R  [RES_0603_H050 (_IPC_MD)]  (hidden comment: 221R 1% 0,1W 75V 0603)
R29  value 221R  [RES_0603_H050 (_IPC_MD)]  (hidden comment: 221R 1% 0,1W 75V 0603)
SOM1  ATMEGA2560  [ATMEGA2560]
U4  MAX4478ASD+  [SOIC127P600X175-14N]  (value not drawn)  (parts A,B,C,D of 4)

### Ports
FAN[1..3] (out), HEAT[1..2] (out), HX711 (in, harness HX711), INLET[1..2] (out), PUMP1_SENSE (in), PUMP2_SENSE (in), PUMP[1..2] (out), PWREN (out), SERIAL0 (in, harness SERIAL0), TERM[1..3] (bidir), VALVE[1..11] (out), VALVE_SENSE (in)

### Harnesses
SERIAL0: RESET, RX, TX
HX711: DT, SCK

### Nets
5VA: C15.1 SOM1.5(5V) U4.4(V+)
12V: R23.1 R24.1 SOM1.8(VIN)
GND: C15.2 D1.2(A) R15.2 R18.1 R20.1 R22.1 R25.2 R28.2 R29.2 SOM1.6(GND) SOM1.7(GND) SOM1.47(GND) SOM1.85(GND) SOM1.86(GND) SOM1.92(GND) SOM1.MH1(MH) SOM1.MH2(MH) SOM1.MH3(MH) SOM1.MH4(MH) SOM1.MH5(MH) U4.11(V-)
A0: R21.2 SOM1.9(A0) U4.8(OUT3)
A1: R19.2 SOM1.10(A1) U4.7(OUT2)
A4: R9.2 SOM1.13(A4) U4.1(OUT1)
DT: SOM1.42(D9) ; port HX711.DT
FAN1: SOM1.41(D8)
FAN2: SOM1.77(D46)
FAN3: SOM1.76(D45)
HEAT1: SOM1.46(D13)
HEAT2: SOM1.37(D4)
INLET1: SOM1.39(D6)
INLET2: SOM1.40(D7)
INT: SOM1.84(SPI_SS) U4.14(OUT4)
LED1: D2.2(A) SOM1.72(D41)
LED2: D3.2(A) SOM1.71(D40)
PUMP1: SOM1.38(D5)
PUMP1_SENSE: U4.10(IN3+) ; port PUMP1_SENSE
PUMP2: SOM1.35(D2)
PUMP2_SENSE: U4.5(IN2+) ; port PUMP2_SENSE
PWREN: SOM1.80(D49) ; port PWREN
RESET: SOM1.3(RESET) ; port SERIAL0.RESET
RX0: SOM1.33(D0) ; port SERIAL0.RX
SCK: SOM1.45(D12) ; port HX711.SCK
TERM1: SOM1.43(D10)
TERM2: SOM1.44(D11)
TERM3: SOM1.11(A2)
TX0: R14.1 SOM1.34(D1)
VALVE1: SOM1.53(D22)
VALVE2: SOM1.54(D23)
VALVE3: SOM1.55(D24)
VALVE4: SOM1.56(D25)
VALVE5: SOM1.57(D26)
VALVE6: SOM1.58(D27)
VALVE7: SOM1.59(D28)
VALVE8: SOM1.60(D29)
VALVE10: SOM1.61(D30)
VALVE11: SOM1.62(D31)
VALVE_SENSE: U4.3(IN1+) ; port VALVE_SENSE
NetD1_1: D1.1(K) R23.2 U4.12(IN4+)
NetD2_1: D2.1(K) R28.1
NetD3_1: D3.1(K) R29.1
NetP5_2: R14.2 R15.1 ; port SERIAL0.TX
NetR9_1: R9.1 R18.2 U4.2(IN1-)
NetR19_1: R19.1 R20.2 U4.6(IN2-)
NetR21_1: R21.1 R22.2 U4.9(IN3-)
NetR24_2: R24.2 R25.1 U4.13(IN4-)

Not connected (* = marked no-connect by the designer): SOM1 4(3.3V) 12(A3) 14(A5) 15(A6) 16(A7) 17(A8) 18(A9) 19(A10) 20(A11) 21(A12) 22(A13) 23(A14) 24(A15) 25(D21) 26(D20) 27(D19) 28(D18) 29(D17) 30(D16) 31(D15) 32(D14) 36(D3) 48(AREF) 49(SDA) 50(SCL) 51(5V) 52(5V) 63(D32) 64(D33) 65(D34) 66(D35) 67(D36) 68(D37) 69(D38) 70(D39) 73(D42) 74(D43) 75(D44) 78(D47) 79(D48) 81(SPI_MISO) 82(SPI_MOSI) 83(SPI_SCK) 87(MISO) 88(5V) 89(SCK) 90(MOSI) 91(RESET)

### Buses and harness runs
bus FAN[1..3] = port FAN[1..3]
bus HEAT[1..2] = port HEAT[1..2]
bus INLET[1..2] = port INLET[1..2]
bus PUMP[1..2] = port PUMP[1..2]
bus TERM[1..3] = port TERM[1..3]
bus VALVE[1..11] = port VALVE[1..11]

### Notes on the sheet
- Pin mapping
  ATMEGA		Arduino
  VALVE1		78		D22	MASH INLET
  VALVE2		77		D23	MASH RETURN
  VALVE3		76		D24	BOIL INLET
  VALVE4		75		D25	BOIL RETURN
  VALVE5		74		D26	HOP3
  VALVE6		73		D27	HOP4
  VALVE7		72		D28	HOP1
  VALVE8		71		D29	HOP2
  VALVE9		69			NC
  VALVE10		68		D30*	COOL
  VALVE11		67		D31*	OUTLET
  PWREN		65		D80*	PWREN
  SENSE		93		A4
  HEAT1		26 		D13	MASH TANK
  HEAT2		1		D4	BOIL TANK
  FAN1		17		D8
  FAN2		38		D46
  FAN3		39		D45
  INLET1		15		D6	COOL INLET
  INLET2		16		D7	WATER INLET
  PUMP1		5		D5	MASH
  SENSE		97		A0
  PUMP2		6		D2	BOIL
  SENSE		96		A1
  TERM1		23		D10	BOIL TANK
  TERM2		24		D11	MASH TANK
  HALL1		95		A2	OnBoard
  HALL2		94		A3	NC
  INT		19		D53
  TX0		3		D1
  RX0		2		D0
  RESET		72		RESET
  DT		14		D9*
  SCK		27		D12*
  LED1		51		D41
  LED2		52		D40
- Labels drawn without touching a wire or pin: 5VA
- (in symbol ATMEGA2560) 6,7

### Library data of the parts
C15 = CL10B104KB8NNNC: as C4 on sheet SUPPLY; Volt: 50V; Part Number: CL10B104KB8NNNC; Dielec: X7R; Qty: 1; Supplier 1: Arrow; Supplier 2: Avnet; Supplier 3: Digi-Key; Supplier Part Number 3: 1276-1000-1-ND; Supplier 4: Distrelec; Supplier 5: Farnell; Supplier 6: Future Electronics; Supplier 7: Mouser; Supplier Part Number 7: 187-CL10B104KB8NNNC; Supplier 8: RSComponents; Supplier 9: Rutronik; Supplier 10: SEED OPL
D1 = LL4148-GS18: Diode; Manufacturer_Name: Vishay; Datasheet Link: https://www.vishay.com/docs/85557/ll4148.pdf; Manufacturer_Part_Number: LL4148-GS18; Mouser Part Number: 78-LL4148-GS18; Mouser Price/Stock: https://www.mouser.co.uk/ProductDetail/Vishay-Semiconductors/LL4148-GS18?qs=YkIJFe%252BtFEUsKqcD4T1jvg%3D%3D; Arrow Part Number: LL4148-GS18; Arrow Price/Stock: https://www.arrow.com/en/products/ll4148-gs18/vishay?region=nac
D2 D3 = 150060GS73220: WL-SMCC SMD Mono-color Chip LED Compact, size 0603, Green, 3.2V, 120deg; Dominant Wavelength: 525nm; Luminous Intensity: 700mcd; Peak Wavelength: 520nm; Chip Technology: InGaN; ComponentLink1URL: http://www.we-online.de; ComponentLink2Description: Datasheet; ComponentLink2URL: https://katalog.we-online.com/led/datasheet/150060GS73220.pdf; Part Number: 150060GS73220; Published Date: July 2019; Publisher: Wurth Elektronik; Size: 0603; Viewing Angle: 120deg; Packaging: Tape and Reel; Emitting Color: Green; Mounting Technology: SMT; Forward Voltage: 3.2V; Operating Temperature: -40 to +85degC
R9 R19 R21 = RES20.0K1%0603: Designator: R; PCB Lib: MUAB_RES.PcbLib; Scm Lib: Discrete.SchLib; Watt: 0,1W; Tol: 1%; Part Number: RES20.0K1%0603; Type: Standard; Volt: 75V; Qty: 1; Supplier 1: Arrow; Supplier 2: Avnet; Supplier 3: Digi-Key; Supplier 4: Distrelec; Supplier 5: Farnell; Supplier 6: Future Electronics; Supplier 7: Mouser; Supplier 8: RSComponents; Supplier 9: Rutronik; Supplier 10: SEED OPL
R14 = RES1.82K1%0603: Designator: R; PCB Lib: MUAB_RES.PcbLib; Scm Lib: Discrete.SchLib; Watt: 0,1W; Tol: 1%; Part Number: RES1.82K1%0603; Type: Standard; Volt: 75V; Qty: 1; Supplier 1: Arrow; Supplier 2: Avnet; Supplier 3: Digi-Key; Supplier 4: Distrelec; Supplier 5: Farnell; Supplier 6: Future Electronics; Supplier 7: Mouser; Supplier 8: RSComponents; Supplier 9: Rutronik; Supplier 10: SEED OPL
R15 = RES3.32K1%0603: Designator: R; PCB Lib: MUAB_RES.PcbLib; Scm Lib: Discrete.SchLib; Watt: 0,1W; Tol: 1%; Part Number: RES3.32K1%0603; Type: Standard; Volt: 75V; Qty: 1; Supplier 1: Arrow; Supplier 2: Avnet; Supplier 3: Digi-Key; Supplier 4: Distrelec; Supplier 5: Farnell; Supplier 6: Future Electronics; Supplier 7: Mouser; Supplier 8: RSComponents; Supplier 9: Rutronik; Supplier 10: SEED OPL
R18 R20 R22 R23 R25 = RES1.00K1%0603: Designator: R; PCB Lib: MUAB_RES.PcbLib; Scm Lib: Discrete.SchLib; Watt: 0,1W; Tol: 1%; Part Number: RES1.00K1%0603; Type: Standard; Volt: 75V; Qty: 1; Supplier 1: Arrow; Supplier 2: Avnet; Supplier 3: Digi-Key; Supplier 4: Distrelec; Supplier 5: Farnell; Supplier 6: Future Electronics; Supplier 7: Mouser; Supplier 8: RSComponents; Supplier 9: Rutronik; Supplier 10: SEED OPL
R24 = RES2.00K1%0603: Designator: R; PCB Lib: MUAB_RES.PcbLib; Scm Lib: Discrete.SchLib; Watt: 0,1W; Tol: 1%; Part Number: RES2.00K1%0603; Type: Standard; Volt: 75V; Qty: 1; Supplier 1: Arrow; Supplier 2: Avnet; Supplier 3: Digi-Key; Supplier 4: Distrelec; Supplier 5: Farnell; Supplier 6: Future Electronics; Supplier 7: Mouser; Supplier 8: RSComponents; Supplier 9: Rutronik; Supplier 10: SEED OPL
R28 R29 = RES221R1%0603: Designator: R; PCB Lib: MUAB_RES.PcbLib; Scm Lib: Discrete.SchLib; Watt: 0,1W; Tol: 1%; Part Number: RES221R1%0603; Type: Standard; Volt: 75V; Qty: 1; Supplier 1: Arrow; Supplier 2: Avnet; Supplier 3: Digi-Key; Supplier 4: Distrelec; Supplier 5: Farnell; Supplier 6: Future Electronics; Supplier 7: Mouser; Supplier 8: RSComponents; Supplier 9: Rutronik; Supplier 10: SEED OPL
U4 = MAX4478ASD+: IC OPAMP GP 2 CIRCUIT 8SOIC; Designator: U?; PCB Lib: MUAB_SO.PcbLib; Scm Lib: Maxim.SchLib; Value: 1; Volt: 2.7V ~ 5.5V; Watt: 48mA; Part Number: MAX4478ASD+; Type: Standard; Qty: 1; Supplier 1: Arrow; Supplier 2: Avnet; Supplier 3: Digi-Key; Supplier Part Number 3: MAX4478ASD+TTR-ND; Supplier 4: Distrelec; Supplier 5: Farnell; Supplier 6: Future Electronics; Supplier 7: Mouser; Supplier Part Number 7: 700-MAX4478ASDT; Supplier 8: RSComponents; Supplier 9: Rutronik; Supplier 10: SEED OPL
SOM1 = ATMEGA2560: Arduino: ATMega 2560

## Sheet TEMP.SchDoc
size A4; SheetNumber: 5; SheetTotal: 5
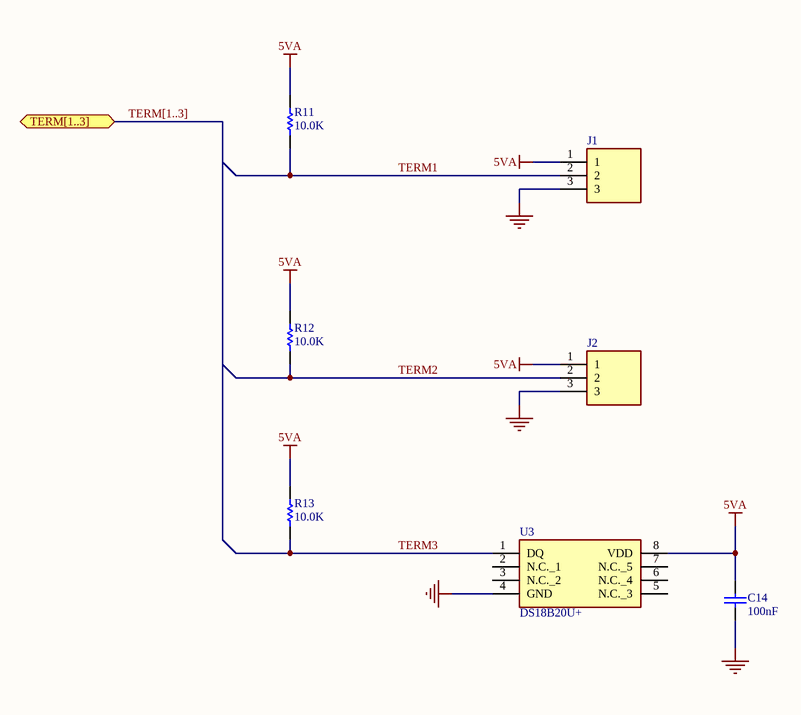
[diagram p3: TEMP.SchDoc]

### Parts
C14  value 100nF  [CAP_0603_H090 (_IPC_MD)]  (hidden comment: 100nF 0603)
J1  B3B-PH-K-S_LF__SN_  [SHDR3W50P0X200_1X3_790X450X600P]  (value not drawn)
J2  B3B-PH-K-S_LF__SN_  [SHDR3W50P0X200_1X3_790X450X600P]  (value not drawn)
R11  value 10.0K  [RES_0603_H050 (_IPC_MD)]  (hidden comment: 10.0K 1% 0,1W 75V 0603)
R12  value 10.0K  [RES_0603_H050 (_IPC_MD)]  (hidden comment: 10.0K 1% 0,1W 75V 0603)
R13  value 10.0K  [RES_0603_H050 (_IPC_MD)]  (hidden comment: 10.0K 1% 0,1W 75V 0603)
U3  DS18B20U+  [SOP65P490X110-8N]

### Ports
TERM[1..3] (bidir)

### Nets
5VA: C14.2 J1.1 J2.1 R11.1 R12.1 R13.1 U3.8(VDD)
GND: C14.1 J1.3 J2.3 U3.4(GND)
TERM1: J1.2 R11.2
TERM2: J2.2 R12.2
TERM3: R13.2 U3.1(DQ)

Not connected (* = marked no-connect by the designer): U3 2(N.C._1) 3(N.C._2) 5(N.C._3) 6(N.C._4) 7(N.C._5)

### Buses and harness runs
bus TERM[1..3] = port TERM[1..3]

### Library data of the parts
C14 = CL10B104KB8NNNC: as C4 on sheet SUPPLY; Volt: 50V; Part Number: CL10B104KB8NNNC; Dielec: X7R; Qty: 1; Supplier 1: Arrow; Supplier 2: Avnet; Supplier 3: Digi-Key; Supplier Part Number 3: 1276-1000-1-ND; Supplier 4: Distrelec; Supplier 5: Farnell; Supplier 6: Future Electronics; Supplier 7: Mouser; Supplier Part Number 7: 187-CL10B104KB8NNNC; Supplier 8: RSComponents; Supplier 9: Rutronik; Supplier 10: SEED OPL
J1 J2 = B3B-PH-K-S_LF__SN_: Connector; Manufacturer_Name: JST (JAPAN SOLDERLESS TERMINALS); Manufacturer_Part_Number: B3B-PH-K-S(LF)(SN); Datasheet Link: http://www.jst-mfg.com/product/pdf/eng/ePH.pdf; Height: 6mm; Arrow Part Number: B3B-PH-K-S(LF)(SN); Arrow Price/Stock: https://www.arrow.com/en/products/b3b-ph-k-s-lf-sn/jst-manufacturing; RS-Online: 8201431P
R11-R13 = RES10.0K1%0603: Designator: R; PCB Lib: MUAB_RES.PcbLib; Scm Lib: Discrete.SchLib; Watt: 0,1W; Tol: 1%; Part Number: RES10.0K1%0603; Type: Standard; Volt: 75V; Qty: 1; Supplier 1: Arrow; Supplier 2: Avnet; Supplier 3: Digi-Key; Supplier 4: Distrelec; Supplier 5: Farnell; Supplier 6: Future Electronics; Supplier 7: Mouser; Supplier 8: RSComponents; Supplier 9: Rutronik; Supplier 10: SEED OPL
U3 = DS18B20U+: Te,perature sensor; Manufacturer_Name: Maxim Integrated; Datasheet Link: https://datasheets.maximintegrated.com/en/ds/DS18B20.pdf; Height: 1.1mm; Manufacturer_Part_Number: DS18B20U+; Mouser Part Number: 700-DS18B20U; Mouser Price/Stock: https://www.mouser.co.uk/ProductDetail/Maxim-Integrated/DS18B20U%2b?qs=7H2Jq%252ByxpJLxAEcPXZtrFQ%3D%3D; Arrow Part Number: DS18B20U+; Arrow Price/Stock: https://www.arrow.com/en/products/ds18b20u/maxim-integrated?region=nac; Supplier 1: RSComponents; Supplier Part Number 1: 1901809P

## Sheet SW.SchDoc
size A4; SheetNumber: 4; SheetTotal: 5
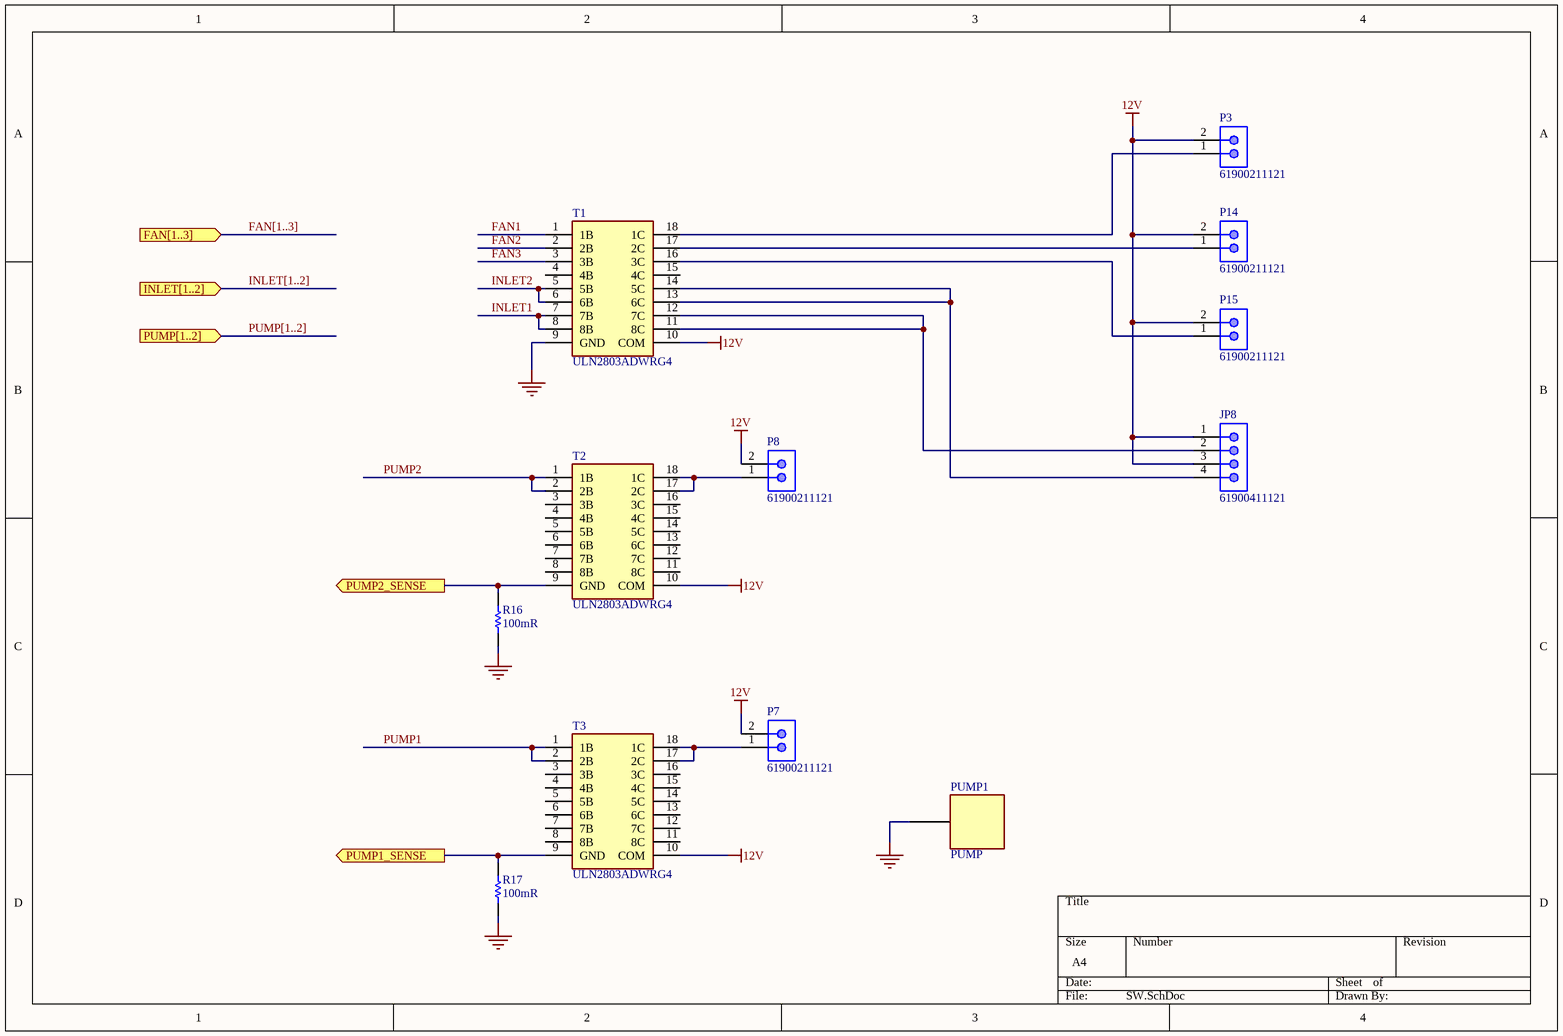
[diagram p4: SW.SchDoc]

### Parts
JP8  61900411121  [61900411121]
P3  61900211121  [61900211121]
P7  61900211121  [61900211121]
P8  61900211121  [61900211121]
P14  61900211121  [61900211121]
P15  61900211121  [61900211121]
PUMP1  PUMP  [PUMP]
R16  value 100mR  [RES_1206_H060 (_IPC_MD)]  (hidden comment: 100mR 1% 0,25W 200V 1206)
R17  value 100mR  [RES_1206_H060 (_IPC_MD)]  (hidden comment: 100mR 1% 0,25W 200V 1206)
T1  ULN2803ADWRG4  [SOIC127P1030X265-18N]
T2  ULN2803ADWRG4  [SOIC127P1030X265-18N]
T3  ULN2803ADWRG4  [SOIC127P1030X265-18N]

### Ports
FAN[1..3] (in), INLET[1..2] (in), PUMP1_SENSE (out), PUMP2_SENSE (out), PUMP[1..2] (in)

### Nets
12V: JP8.1 JP8.3 P3.2 P7.2 P8.2 P14.2 P15.2 T1.10(COM) T2.10(COM) T3.10(COM)
GND: PUMP1.0(CONN) R16.1 R17.1 T1.9(GND)
FAN1: T1.1(1B)
FAN2: T1.2(2B)
FAN3: T1.3(3B)
INLET1: T1.7(7B) T1.8(8B)
INLET2: T1.5(5B) T1.6(6B)
PUMP1: T3.1(1B) T3.2(2B)
PUMP1_SENSE: R17.2 T3.9(GND) ; port PUMP1_SENSE
PUMP2: T2.1(1B) T2.2(2B)
PUMP2_SENSE: R16.2 T2.9(GND) ; port PUMP2_SENSE
NetJP8_2: JP8.2 T1.11(8C) T1.12(7C)
NetJP8_4: JP8.4 T1.13(6C) T1.14(5C)
NetP3_1: P3.1 T1.18(1C)
NetP7_1: P7.1 T3.17(2C) T3.18(1C)
NetP8_1: P8.1 T2.17(2C) T2.18(1C)
NetP14_1: P14.1 T1.17(2C)
NetP15_1: P15.1 T1.16(3C)

Not connected (* = marked no-connect by the designer): T1 4(4B) 15(4C); T2 3(3B) 4(4B) 5(5B) 6(6B) 7(7B) 8(8B) 11(8C) 12(7C) 13(6C) 14(5C) 15(4C) 16(3C); T3 3(3B) 4(4B) 5(5B) 6(6B) 7(7B) 8(8B) 11(8C) 12(7C) 13(6C) 14(5C) 15(4C) 16(3C)

### Buses and harness runs
bus FAN[1..3] = port FAN[1..3]
bus INLET[1..2] = port INLET[1..2]
bus PUMP[1..2] = port PUMP[1..2]

### Library data of the parts
JP8 = 61900411121: as JP4 on sheet CPU_top; ComponentLink1Description: Manufacturer; ComponentLink1URL: http://www.we-online.de; ComponentLink2Description: Datasheet; ComponentLink2URL: https://www.we-online.com/catalog/datasheet/61900411121.pdf; Pitch: 2.54mm; Published Date: January 2020; Publisher: Wurth Elektronik; Mounting Technology: THT; Packaging: Bag; Operating Temperature: -40 to +105degC; Part Number: 61900411121; Gender: Male; Type: Vertical
P3 P7 P8 P14 P15 = 61900211121: WR-WTB THT Male Vertical Locking Header, pitch 2.54mm, 2p; Pin Number: 2; Contact Resistance: 20mOhm; Rated Current: 3A; Withstanding Voltage: 1000VAC; Working Voltage: 250VAC; ComponentLink1Description: Manufacturer; ComponentLink1URL: http://www.we-online.de; ComponentLink2Description: Datasheet; ComponentLink2URL: https://www.we-online.com/catalog/datasheet/61900211121.pdf; Pitch: 2.54mm; Published Date: January 2020; Publisher: Wurth Elektronik; Mounting Technology: THT; Packaging: Bag; Operating Temperature: -40 to +105degC; Part Number: 61900211121; Gender: Male; Type: Vertical
R16 R17 = RES100mR1%1206: as R10 on sheet CPU_top; Tol: 1%; Part Number: RES100mR1%1206; Type: Standard; Volt: 200V; Qty: 1; Supplier 1: Arrow; Supplier 2: Avnet; Supplier 3: Digi-Key; Supplier 4: Distrelec; Supplier 5: Farnell; Supplier 6: Future Electronics; Supplier 7: Mouser; Supplier 8: RSComponents; Supplier 9: Rutronik; Supplier 10: SEED OPL
T1-T3 = ULN2803ADWRG4: Darlington; Manufacturer_Name: Texas Instruments; Datasheet Link: http://www.ti.com/lit/ds/symlink/uln2803a.pdf; Height: 2.65mm; Manufacturer_Part_Number: ULN2803ADWRG4; Mouser Part Number: 595-ULN2803ADWRG4; Mouser Price/Stock: https://www.mouser.co.uk/ProductDetail/Texas-Instruments/ULN2803ADWRG4?qs=pbofycSusePr3zMQZfJ%2FRA%3D%3D; Arrow Part Number: ULN2803ADWRG4; Arrow Price/Stock: https://www.arrow.com/en/products/uln2803adwrg4/texas-instruments; Supplier 1: Mouser; Supplier Part Number 1: 595-ULN2803ADWRG4

## Nets that join several sheets
5V: CPU_top (P5.1), SUPPLY (C6.2 C7.2 L2.2 R3.2)
5VA: CPU_top (JP4.1), Arduino (C15.1 SOM1.5 U4.4), TEMP (7 pins)
7V: CPU_top (9 pins), SUPPLY (C11.2 C12.2 L3.2 R6.2)
12V: CPU_top (C16.2 JP5.5 U5.3), SUPPLY (5 pins), Arduino (R23.1 R24.1 SOM1.8), SW (10 pins)
GND: CPU_top (14 pins), SUPPLY (16 pins), Arduino (21 pins), TEMP (C14.1 J1.3 J2.3 U3.4), SW (PUMP1.0 R16.1 R17.1 T1.9)
DT: CPU_top (P4.2), Arduino (SOM1.42)
FAN1: Arduino (SOM1.41), SW (T1.1)
FAN2: Arduino (SOM1.77), SW (T1.2)
FAN3: Arduino (SOM1.76), SW (T1.3)
HEAT1: CPU_top (JP4.2), Arduino (SOM1.46)
HEAT2: CPU_top (JP4.3), Arduino (SOM1.37)
INLET1: Arduino (SOM1.39), SW (T1.7 T1.8)
INLET2: Arduino (SOM1.40), SW (T1.5 T1.6)
NetP5_2: CPU_top (P5.2), Arduino (R14.2 R15.1)
PUMP1: Arduino (SOM1.38), SW (T3.1 T3.2)
PUMP1_SENSE: Arduino (U4.10), SW (R17.2 T3.9)
PUMP2: Arduino (SOM1.35), SW (T2.1 T2.2)
PUMP2_SENSE: Arduino (U4.5), SW (R16.2 T2.9)
PWREN: SUPPLY (U2.3), Arduino (SOM1.80)
RESET: CPU_top (P5.5), Arduino (SOM1.3)
RX0: CPU_top (P5.3), Arduino (SOM1.33)
SCK: CPU_top (P4.3), Arduino (SOM1.45)
TERM1: Arduino (SOM1.43), TEMP (J1.2 R11.2)
TERM2: Arduino (SOM1.44), TEMP (J2.2 R12.2)
TERM3: Arduino (SOM1.11), TEMP (R13.2 U3.1)
VALVE1: CPU_top (P1.3), Arduino (SOM1.53)
VALVE2: CPU_top (P2.3), Arduino (SOM1.54)
VALVE3: CPU_top (P9.3), Arduino (SOM1.55)
VALVE4: CPU_top (P10.3), Arduino (SOM1.56)
VALVE5: CPU_top (P6.3), Arduino (SOM1.57)
VALVE6: CPU_top (P6.6), Arduino (SOM1.58)
VALVE7: CPU_top (P6.5), Arduino (SOM1.59)
VALVE8: CPU_top (P6.7), Arduino (SOM1.60)
VALVE10: CPU_top (P12.3), Arduino (SOM1.61)
VALVE11: CPU_top (P13.3), Arduino (SOM1.62)
VALVE_SENSE: CPU_top (10 pins), Arduino (U4.3)